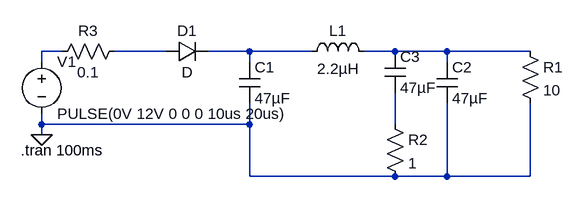
[diagram p0: schematic 12V input dampening.asc]
12V input dampening.asc, the LTspice schematic file:
Version 4
SHEET 1 880 680
WIRE -80 128 -112 128
WIRE 80 128 0 128
WIRE 208 128 144 128
WIRE 304 128 208 128
WIRE 432 128 384 128
WIRE 512 128 432 128
WIRE 640 128 512 128
WIRE -112 144 -112 128
WIRE 208 144 208 128
WIRE 512 144 512 128
WIRE -112 240 -112 224
WIRE 208 240 208 208
WIRE 208 240 -112 240
WIRE 432 240 432 192
WIRE -112 256 -112 240
WIRE 208 320 208 240
WIRE 432 320 208 320
WIRE 512 320 512 208
WIRE 512 320 432 320
WIRE 640 320 640 208
WIRE 640 320 512 320
FLAG -112 256 0
SYMBOL voltage -112 128 R0
WINDOW 123 0 0 Left 0
WINDOW 39 0 0 Left 0
SYMATTR InstName V1
SYMATTR Value PULSE(0V 12V 0 0 0 10us 20us)
SYMBOL cap 192 144 R0
SYMATTR InstName C1
SYMATTR Value 47µF
SYMBOL cap 496 144 R0
SYMATTR InstName C2
SYMATTR Value 47µF
SYMBOL ind 288 144 R270
WINDOW 0 32 56 VTop 2
WINDOW 3 5 56 VBottom 2
SYMATTR InstName L1
SYMATTR Value 2.2µH
SYMBOL res 624 112 R0
SYMATTR InstName R1
SYMATTR Value 10
SYMBOL res 416 224 R0
SYMATTR InstName R2
SYMATTR Value 1
SYMBOL cap 416 128 R0
SYMATTR InstName C3
SYMATTR Value 47µF
SYMBOL res 16 112 R90
WINDOW 0 0 56 VBottom 2
WINDOW 3 32 56 VTop 2
SYMATTR InstName R3
SYMATTR Value 0.1
SYMBOL diode 80 144 R270
WINDOW 0 32 32 VTop 2
WINDOW 3 0 32 VBottom 2
SYMATTR InstName D1
TEXT -144 280 Left 2 !.tran 100ms

The netlist it stands for:
* 12V input dampening.asc
V1 N001 0 PULSE(0V 12V 0 0 0 10us 20us)
C1 N003 0 47µF
C2 N004 0 47µF
L1 N003 N004 2.2µH
R1 N004 0 10
R2 N005 0 1
C3 N004 N005 47µF
R3 N002 N001 0.1
D1 N002 N003 D
.model D D
.lib standard.dio
.tran 100ms
.backanno
.end